# EAGLE design Led_Board (EAGLE 9.0.0)
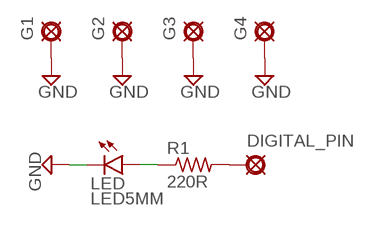
[diagram p0: schematic, sheet 1]

## Parts
DIGITAL_PIN  PADO  [ROUND]
G1  PADO  [ROUND]
G2  PADO  [ROUND]
G3  PADO  [ROUND]
G4  PADO  [ROUND]
LED  LED5MM  [LED5MM]
R1  220R  6MM.3  [R0207/3]

## Nets
GND: G1.1(PAD) G2.1(PAD) G3.1(PAD) G4.1(PAD) LED.K(C)
N$1: LED.A R1.1
N$2: DIGITAL_PIN.1(PAD) R1.2

## Library data of the parts
DIGITAL_PIN G1-G4 = mb_supply:PAD: PAD use this package for pads with any purpose, including input, output, send or return various pad shapes: round, square, octogonal, long, and long offset
LED = mb_diodes:LED
R1 = mb_resistors:6MM: 6mm Resistors Leads spaced 1-6 holes apart for 0.1" perfboard. Suitable for 1/4 watt resistors.

## Board
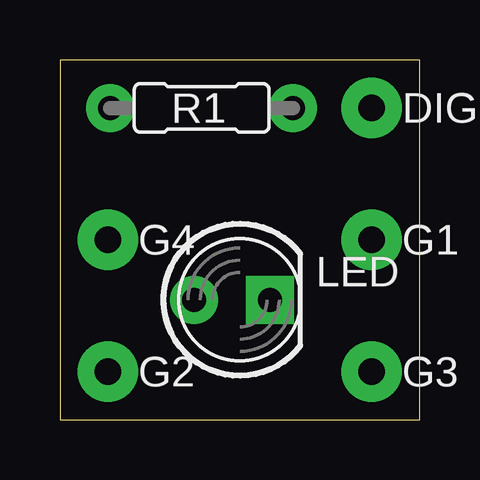
[diagram p1: board, top side]
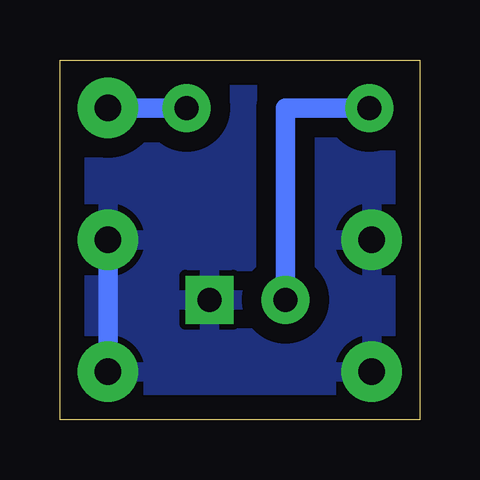
[diagram p2: board, bottom side, seen from below]

Size 15 x 15 mm. Coordinates in mm from the lower left corner, seen from the top.
Outline: 0,0 15,0 15,15 0,15 0,0
Copper layers (1*16): Top 0.035mm / dielectric 1.5mm / Bottom 0.035mm
Design rules "default": minimum track width 6mil, minimum drill 0.35mm, track to track 6mil, track to pad 6mil, pad to pad 6mil, via to via 6mil, smd to smd 6mil, copper to edge 40mil, drill to drill 6mil, minimum pad ring 10mil, minimum via ring 8mil, stop-mask expansion 4mil, vias tented up to drill 0mil, thermal gap 10mil

### Footprints (pad centres in the part's own frame; a part is rotated, then mirrored left to right if it is on the bottom)
ROUND = drill 1.1 pad 2.54: 1 0,0
LED5MM = drill 1 pad 2: A -1.905,0 | drill 1 pad 2 square: K 1.27,0
R0207/3 = drill 1 pad 2: 1 -3.81,0; 2 3.81,0

### Placement (x,y rotation side)
DIGITAL_PIN  13,13 0 top
G1  13,7.5 0 top
G2  2,2 0 top
G3  13,2 0 top
G4  2,7.5 0 top
LED  7.5,5 0 top
R1  5.91,13 0 top

### Tracks (layer width: path | path; a pad name or v marks a point on that pad's centre or on a via)
GND
  Bottom 0.813: G3.1 G1.1
  pour Bottom (isolate 0.813): -2.54,21.59 30.48,21.59 30.48,-2.54 -2.54,-2.54
N$1
  Bottom 0.813: 5.08,5.08 LED.A 5.59,13 R1.1
N$2
  Bottom 0.813: R1.2 DIGITAL_PIN.1